# EAGLE design MPPTBatteryCharger (EAGLE 9.3.2)
Assembly variants: Wing, Hull
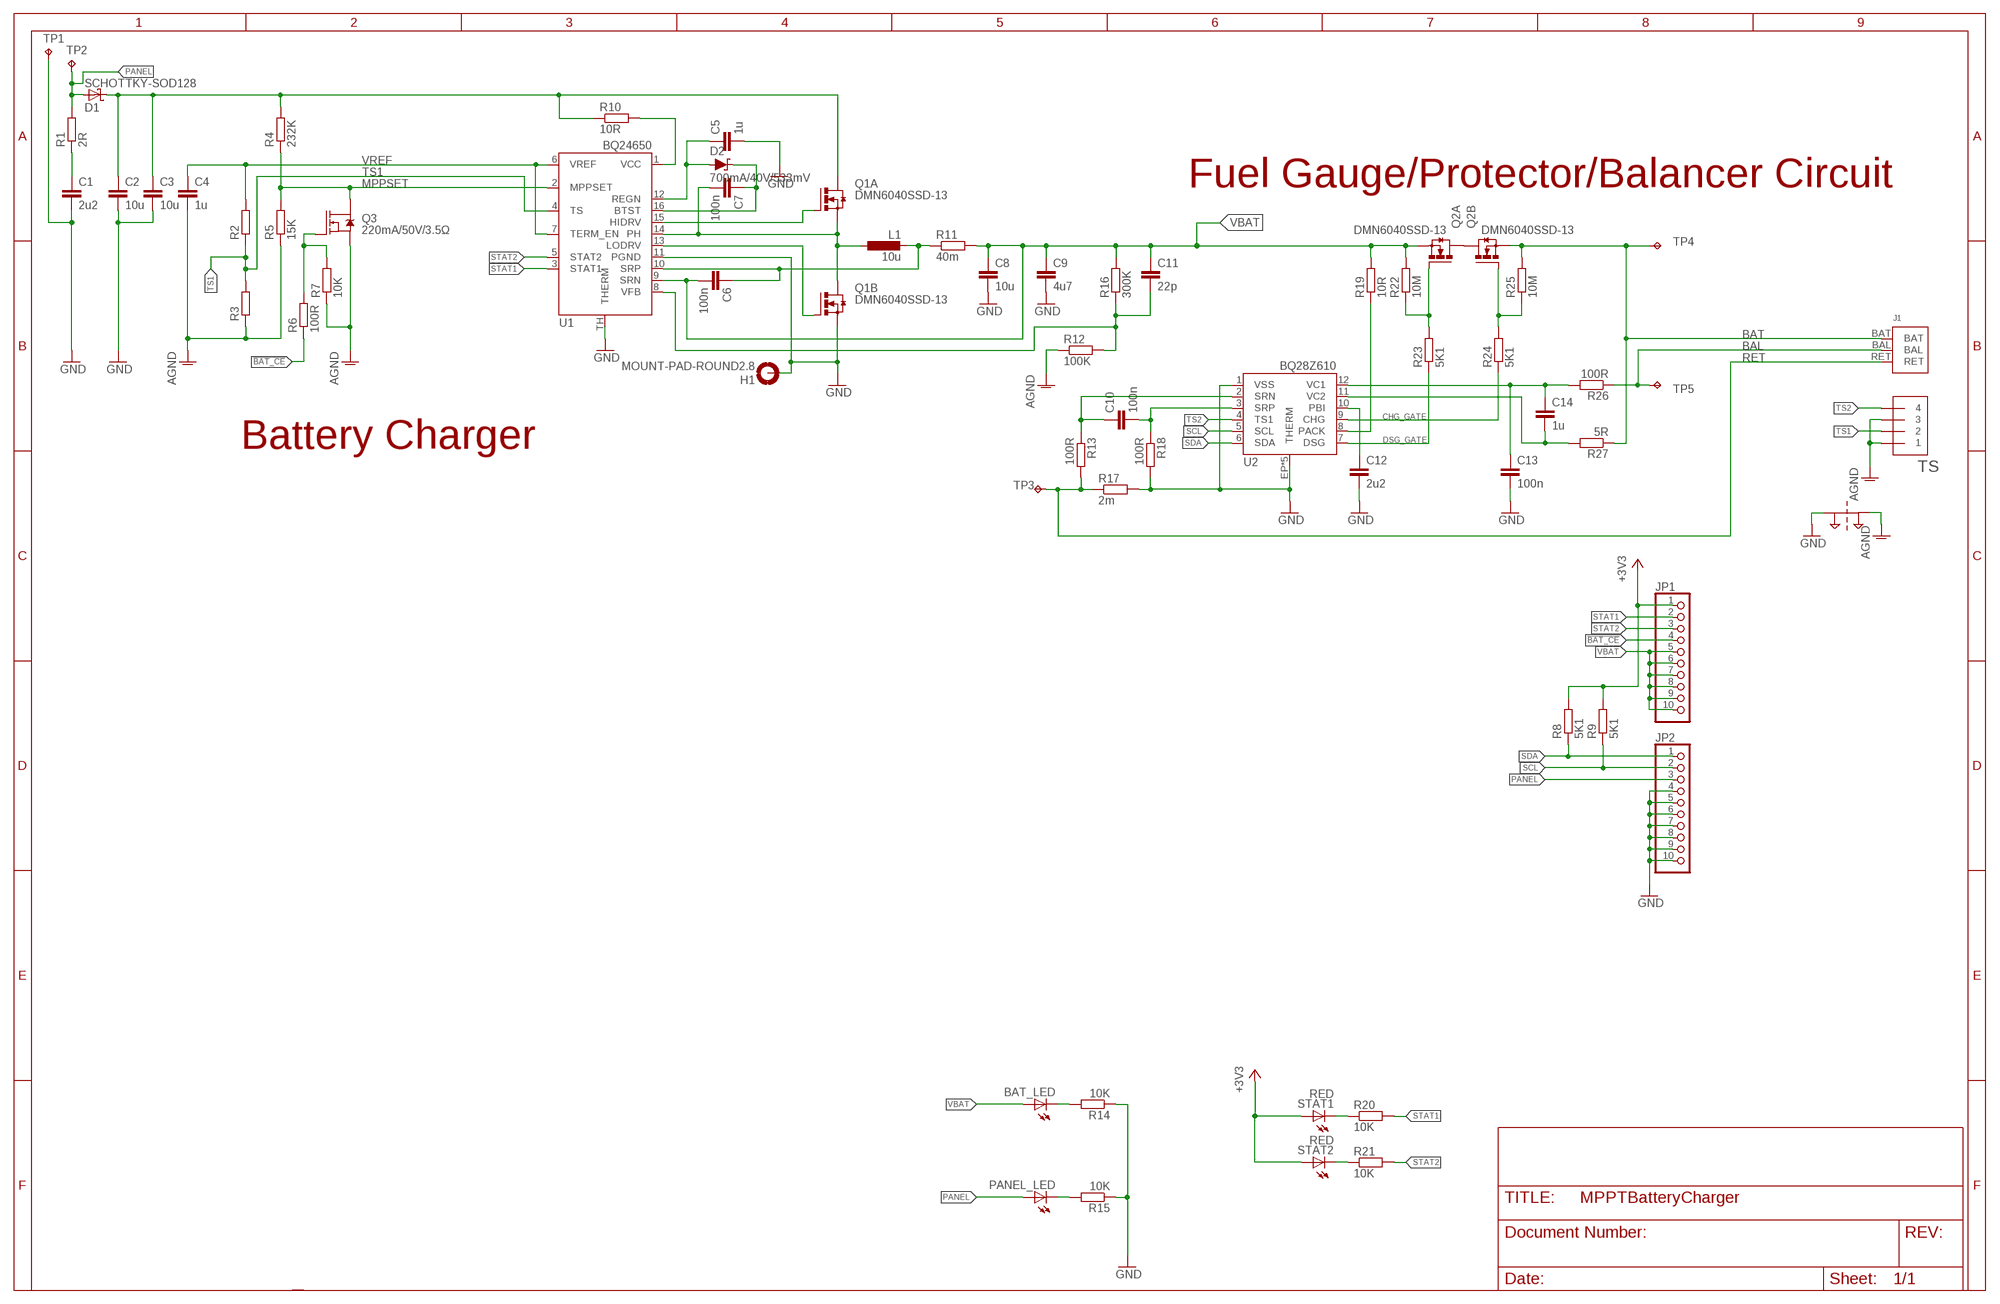
[diagram p0: schematic, sheet 1]

## Parts
BAT_LED  LEDCHIP-LED0603  [CHIP-LED0603]
C1  2u2  C-EUC0603  [C0603]
C2  10u  C-EUC1210  [C1210]
C3  10u  C-EUC1210  [C1210]
C4  1u  C-EUC0603  [C0603]
C5  1u  C-EUC0603  [C0603]
C6  100n  C-EUC0603  [C0603]
C7  100n  C-EUC0603  [C0603]
C8  10u  C-EUC1210  [C1210]
C9  4u7  C-EUC1210  [C1210]
C10  100n  C-EUC0603  [C0603]
C11  22p  C-EUC0603  [C0603]
C12  2u2  C-EUC0603  [C0603]
C13  100n  C-EUC0603  [C0603]
C14  1u  C-EUC0603  [C0603]
D1  SCHOTTKY-SOD128  [SOD-128]
D2  700mA/40V/533mV  DIODE-SCHOTTKY-ZLLS500  [SOT23-3]
H1  MOUNT-PAD-ROUND2.8  [2,8-PAD]
J1  2S-BATTERYSMD  [JST-XH3-SMD]
JP1  PINHD-1X10  [1X10]
JP2  PINHD-1X10  [1X10]
L1  10u  INDUCTOR-DG6050  [DG6050]
PANEL_LED  LEDCHIP-LED0603  [CHIP-LED0603]
Q1  DMN6040SSD-13  IRF8313P  [SO-08]
Q2  DMN6040SSD-13  IRF8313P  [SO-08]
Q3  220mA/50V/3.5Ω  MOSFET-NCH-BSS138  [SOT23-3]
R1  2R  R-EU_R0603  [R0603]
R2  R-EU_R0603  [R0603]
R3  R-EU_R0603  [R0603]
R4  232K  R-EU_R0603  [R0603]
R5  15K  R-EU_R0603  [R0603]
R6  100R  R-EU_R0603  [R0603]
R7  10K  R-EU_R0603  [R0603]
R8  5K1  R-EU_R0603  [R0603]
R9  5K1  R-EU_R0603  [R0603]
R10  10R  R-EU_R1206  [R1206]
R11  40m  R-EU_R2512  [R2512]
R12  100K  R-EU_R0603  [R0603]
R13  100R  R-EU_R0603  [R0603]
R14  10K  R-EU_R0603  [R0603]
R15  10K  R-EU_R0603  [R0603]
R16  300K  R-EU_R0603  [R0603]
R17  2m  R-EU_R2512  [R2512]
R18  100R  R-EU_R0603  [R0603]
R19  10R  R-EU_R0603  [R0603]
R20  10K  R-EU_R0603  [R0603]
R21  10K  R-EU_R0603  [R0603]
R22  10M  R-EU_R0603  [R0603]
R23  5K1  R-EU_R0603  [R0603]
R24  5K1  R-EU_R0603  [R0603]
R25  10M  R-EU_R0603  [R0603]
R26  100R  R-EU_R0603  [R0603]
R27  5R  R-EU_R0603  [R0603]
STAT1  RED  LEDCHIP-LED0603  [CHIP-LED0603]
STAT2  RED  LEDCHIP-LED0603  [CHIP-LED0603]
SUPPLY1  2PT_GND_TIE  [2PT_GND_TIE]  (not fitted in variant Wing)  (not fitted in variant Hull)
TP1  TPPAD1-13Y  [P1-13Y]  (not fitted in variant Wing)  (not fitted in variant Hull)
TP2  TPPAD1-13Y  [P1-13Y]  (not fitted in variant Wing)  (not fitted in variant Hull)
TP3  TPPAD1-13Y  [P1-13Y]  (not fitted in variant Wing)  (not fitted in variant Hull)
TP4  TPPAD1-13Y  [P1-13Y]  (not fitted in variant Wing)  (not fitted in variant Hull)
TP5  TPPAD1-13Y  [P1-13Y]  (not fitted in variant Wing)  (not fitted in variant Hull)
TS  STRAWSON_EAGLE_LIB_JST_SH_4  [STRAWSON_EAGLE_LIB_JST_SH_4_SMD]
U1  BQ24650  [QFN16]
U2  BQ28Z610  [PDSO-N12]

## Nets
!BAT_CE!: JP1.4 R6.1
+3V3: JP1.1 R8.2 R9.2 STAT1.A STAT2.A
AGND: C4.2 Q3.2(S) R3.1 R5.1 R7.1 R12.1 SUPPLY1.P$2 TS.1 TS.3
BAL: J1.BAL R26.1 TP5.TP
BAT: J1.BAT Q2.1(B:S) R25.2 R27.1 TP4.TP
CHG_GATE: R24.1 U2.9(CHG)
DSG_GATE: R23.1 U2.7(DSG)
GND: C1.2 C2.2 C3.2 C5.2 C8.2 C9.2 C12.2 C13.2 H1.B2,8(MOUNT) JP2.4 JP2.5 JP2.6 JP2.7 JP2.8 JP2.9 JP2.10 Q1.1(B:S) R14.1 R15.1 R17.2 R18.2 SUPPLY1.P$1 TP1.TP U1.11(PGND) U1.TH(THERM) U2.1(VSS) U2.EP1(THERM) U2.EP2(THERM) U2.EP3(THERM) U2.EP4(THERM) U2.EP(THERM)
MPPSET: Q3.3(D) R4.1 R5.2 U1.2(MPPSET)
N$1: C1.1 R1.1
N$3: R10.2 U1.1(VCC)
N$4: C2.1 C3.1 D1.C Q1.5(A:D) Q1.6(A:D) R4.2 R10.1
N$5: Q1.4(A:G) U1.15(HIDRV)
N$6: C7.2 L1.1 Q1.3(A:S) Q1.7(B:D) Q1.8(B:D) U1.14(PH)
N$7: Q1.2(B:G) U1.13(LODRV)
N$8: Q3.1(G) R6.2 R7.2
N$9: C6.1 L1.2 R11.1 U1.10(SRP)
N$10: C7.1 D2.3(C) U1.16(BTST)
N$11: C5.1 D2.1(A) U1.12(REGN)
N$12: C11.2 R12.2 R16.1 U1.8(VFB)
N$14: R20.1 STAT1.C
N$18: R19.1 U2.8(PACK)
N$25: Q2.5(A:D) Q2.6(A:D) Q2.7(B:D) Q2.8(B:D)
N$26: Q2.4(A:G) R22.1 R23.2
N$28: Q2.2(B:G) R24.2 R25.1
N$32: C13.1 C14.1 R26.2 U2.12(VC1)
N$33: C14.2 R27.2 U2.11(VC2)
N$34: C12.1 U2.10(PBI)
N$37: C10.1 R13.1 U2.2(SRN)
N$39: C10.2 R18.1 U2.3(SRP)
N$47: R21.1 STAT2.C
N$81: BAT_LED.C R14.2
N$83: PANEL_LED.C R15.2
PANEL: D1.A JP2.3 PANEL_LED.A R1.2 TP2.TP
RET: J1.RET R13.2 R17.1 TP3.TP
SCL: JP2.2 R9.1 U2.5(SCL)
SDA: JP2.1 R8.1 U2.6(SDA)
STAT1: JP1.2 R20.2 U1.3(STAT1)
STAT2: JP1.3 R21.2 U1.5(STAT2)
TS1: R2.1 R3.2 TS.2 U1.4(TS)
TS2: TS.4 U2.4(TS1)
VBAT: BAT_LED.A C6.2 C8.1 C9.1 C11.1 JP1.5 JP1.6 JP1.7 JP1.8 JP1.9 JP1.10 Q2.3(A:S) R11.2 R16.2 R19.2 R22.2 U1.9(SRN)
VREF: C4.1 R2.2 U1.6(VREF) U1.7(TERM_EN)

## Notes on the sheet
- Fuel Gauge/Protector/Balancer Circuit
- Battery Charger

## Library data of the parts
BAT_LED PANEL_LED STAT1 STAT2 = adafruit:LED: LED OSRAM: - CHIPLED LG R971, LG N971, LY N971, LG Q971, LY Q971, LO R971, LY R971 LH N974, LH R974 LS Q976, LO Q976, LY Q976 LO Q996 - Hyper CHIPLED LW Q18S LB Q993, LB Q99A, LB R99A - SideLED LS A670, LO A670, LY A670, LG A670, LP A670 LB A673, LV A673, LT A673, LW A673 LH A674 LY A675 LS A676, LA A676, LO A676, LY A676, LW A676 LS A679, LY A679, LG A679 - Hyper Micro SIDELED® LS Y876, LA Y876, LO Y876, LY Y876 LT Y87S - SmartLED LW L88C, LW L88S LB L89C, LB L89S, LG L890 LS L89K, LO L89K, LY L89K LS L896, LA L896, LO L896, LY L896 - TOPLED LS T670, LO T670, LY T670, LG T670, LP T670 LSG T670, LSP T670, LSY T670, LOP T670, LYG T670 LG T671, LOG T671, LSG T671 LB T673, LV T673, LT T673, LW T673 LH T674 LS T676, LA T676, LO T676, LY T676, LB T676, LH T676, LSB T676, LW T676 LB T67C, LV T67C, LT T67C, LS T67K, LO T67K, LY T67K, LW E67C LS E67B, LA E67B, LO E67B, LY E67B, LB E67C, LV E67C, LT E67C LW T67C LS T679, LY T679, LG T679 LS T770, LO T770, LY T770, LG T770, LP T770 LB T773, LV T773, LT T773, LW T773 LH T774 LS E675, LA E675, LY E675, LS T675 LS T776, LA T776, LO T776, LY T776, LB T776 LHGB T686 LT T68C, LB T68C - Hyper Mini TOPLED® LB M676 - Mini TOPLED Santana® LG M470 LS M47K, LO M47K, LY M47K Source: http://www.osram.convergy.de/
C1-C14 = resistor:C-EU: CAPACITOR, European symbol
D1 = PowerComponents:SCHOTTKY
D2 = SparkFun-DiscreteSemi:DIODE-SCHOTTKY: Schottky diode A Schottky diode is a semiconductor diode which has a low forward voltage drop and a very fast switching action.; PROD_ID: DIO-08411
H1 = holes:MOUNT-PAD-ROUND: MOUNTING PAD, round
J1 = PowerComponents:2S-BATTERY: JST XH connector for a 2S LiPo battery with balancing
JP1 JP2 = pinhead:PINHD-1X10: PIN HEADER
L1 = PowerComponents:INDUCTOR
Q1 Q2 = transistor-power:IRF8313P: HEXFET(R) Power MOSFET Source: Data sheet <http://www.irf.com/product-info/datasheets/data/irf8313pbf.pdf>
Q3 = SparkFun-DiscreteSemi:MOSFET-NCH: N-channel MOSFETs Voltage controlled devices that allow control of high current outputs. SparkFun Products: SparkFun OpenScale <https://www.sparkfun.com/products/13261> SparkFun Digital Sandbox <https://www.sparkfun.com/products/12651> SparkFun Monster Moto Shield <https://www.sparkfun.com/products/10182> SparkFun MOSFET Power Controller <https://www.sparkfun.com/products/11214>; PROD_ID: TRANS-00830
R1-R27 = resistor:R-EU_: RESISTOR, European symbol
SUPPLY1 = SparkFun-PowerSymbols:2PT_GND_TIE: Dual Ground Supply Power supply symbol for connecting two grounds. SparkFun Products: SparkFun AutoDriver - Stepper Motor Driver <https://www.sparkfun.com/products/11611>
TP1-TP5 = testpad:TP: Test pad
TS = BeagleBone_Blue:STRAWSON_EAGLE_LIB_JST_SH_4
U1 = PowerComponents:BQ24650: TI LiPo charger with MPPT
U2 = PowerComponents:BQ28Z610: 2S LiPo balancer/fuel gauge

## Board
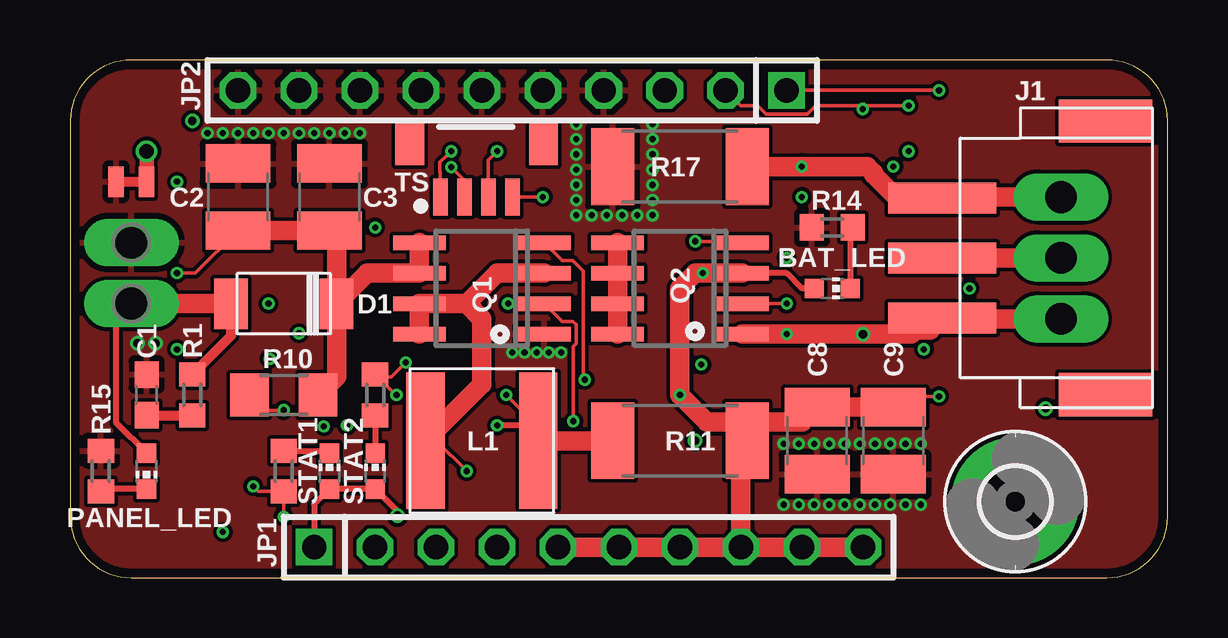
[diagram p1: board, top side]
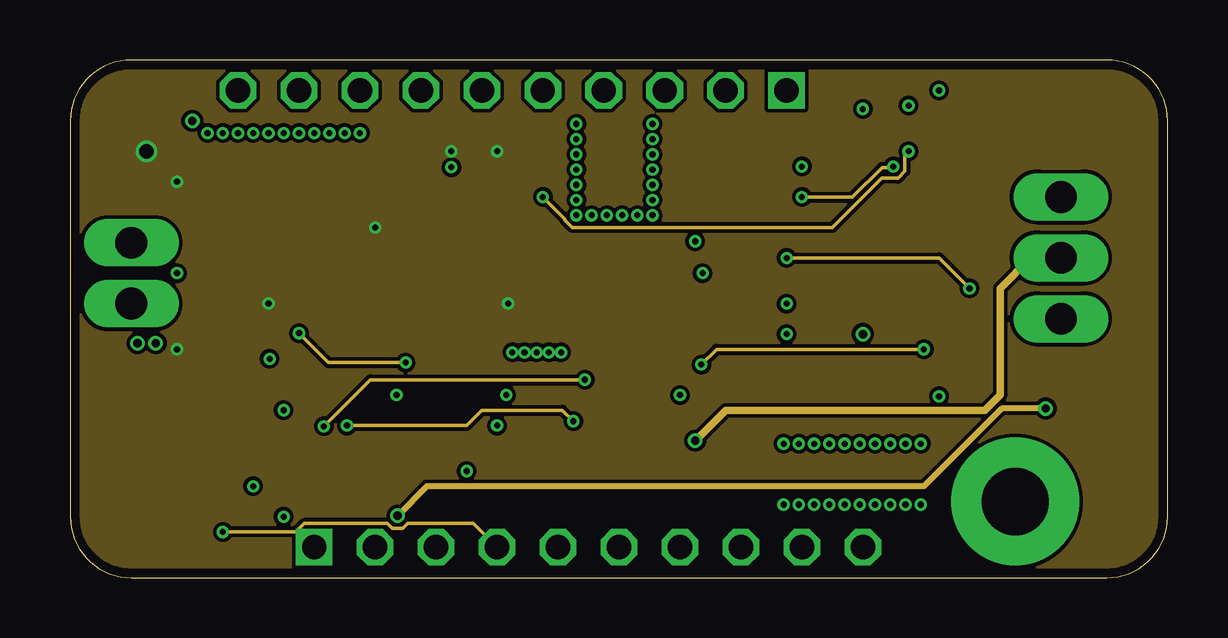
[diagram p2: board, inner layer Route2]
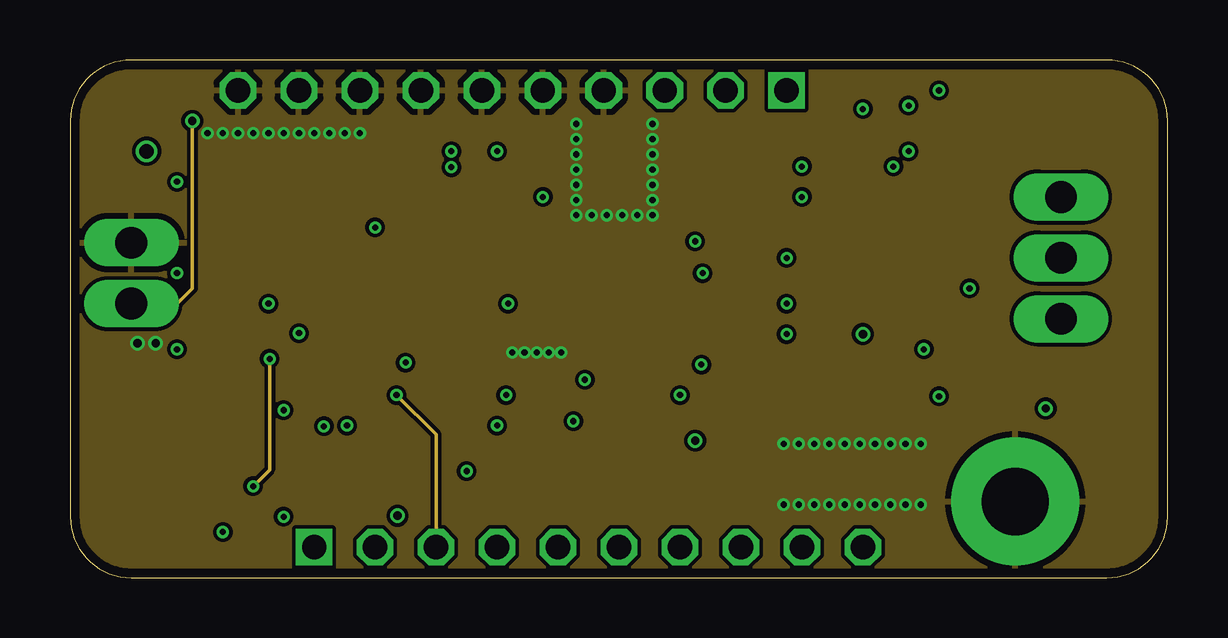
[diagram p3: board, inner layer Route15]
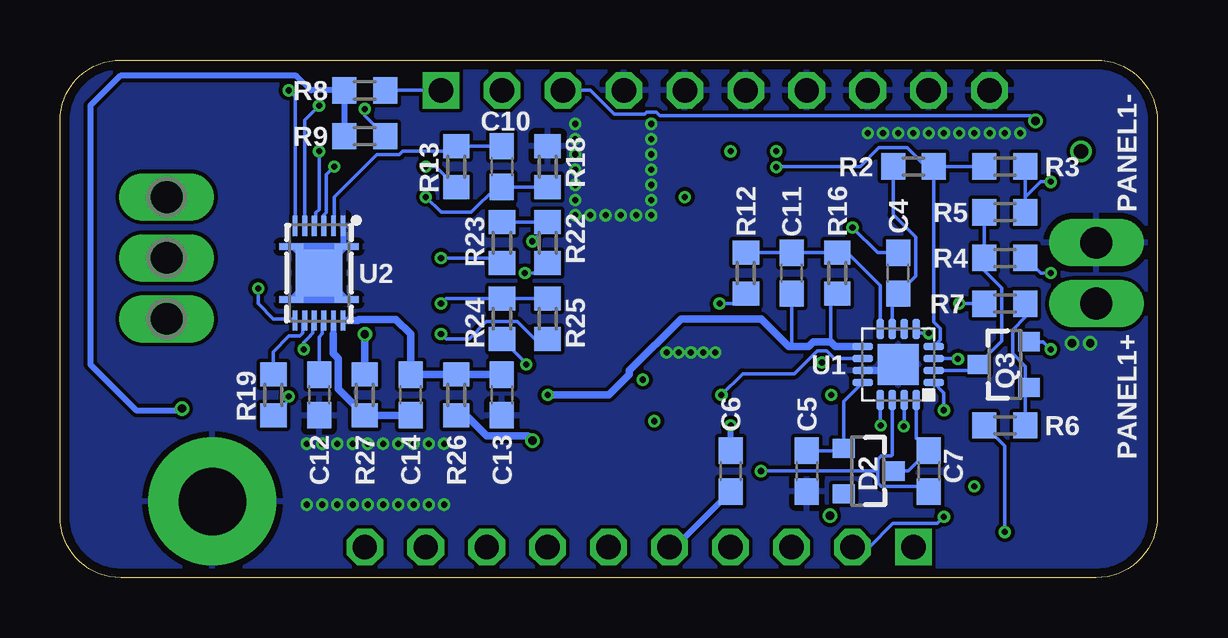
[diagram p4: board, bottom side, seen from below]

Size 45.72 x 21.59 mm. Coordinates in mm from the lower left corner, seen from the top.
Outline: 0,19.05 0,2.54 arc90 2.54,0 43.18,0 arc90 45.72,2.54 45.72,19.05 arc90 43.18,21.59 2.54,21.59 arc90 0,19.05
Copper layers (1+2*15+16): Top 0.0356mm / dielectric 1.5011mm / Route2 0.0356mm / dielectric 0.1499mm / Route15 0.0356mm / dielectric 0.2007mm / Bottom 0.0356mm
Design rules "LaenPCBOrder *": minimum track width 6mil, minimum drill 10mil, track to track 6mil, track to pad 6mil, pad to pad 6mil, via to via 6mil, smd to smd 6mil, copper to edge 15mil, drill to drill 6mil, minimum pad ring 7mil, minimum via ring 5mil, stop-mask expansion 4mil, vias tented up to drill 30mil, thermal gap 10mil

### Footprints (pad centres in the part's own frame; a part is rotated, then mirrored left to right if it is on the bottom)
CHIP-LED0603 = smd 0.8 x 0.8: A 0,-0.75; C 0,0.75
C0603 = smd 1.1 x 1: 1 -0.85,0; 2 0.85,0
C1210 = smd 1.6 x 2.7: 1 -1.4,0; 2 1.4,0
SOD-128 = smd 1.4 x 2.1: A -2.2,0; C 2.2,0
SOT23-3 = smd 0.8 x 0.9: 1 -0.95,-1; 2 0.95,-1; 3 0,1.1
2,8-PAD = drill 2.8 pad 5.334: B2,8 0,0
JST-XH3-SMD = smd 1.3 x 4.5: BAL 0,-8.75; BAT 2.5,-8.75; RET -2.5,-8.75 | smd 1.8 x 3.9: GND1 -5.7,-1.95; GND2 5.7,-1.95
1X10 = drill 1.016 square: 1 -11.43,0 | drill 1.016 octagon: 2 -8.89,0; 3 -6.35,0; 4 -3.81,0; 5 -1.27,0; 6 1.27,0; 7 3.81,0; 8 6.35,0; 9 8.89,0; 10 11.43,0
DG6050 = smd 1.6 x 5.7: 1 -2.35,0; 2 2.35,0
SO-08 = smd 0.6 x 2.2: 1 -1.905,-2.6; 2 -0.635,-2.6; 3 0.635,-2.6; 4 1.905,-2.6; 5 1.905,2.6; 6 0.635,2.6; 7 -0.635,2.6; 8 -1.905,2.6
R0603 = smd 1 x 1.1: 1 -0.85,0; 2 0.85,0
R1206 = smd 1.6 x 1.803: 1 -1.422,0; 2 1.422,0
R2512 = smd 1.8 x 3.2: 1 -2.8,0; 2 2.8,0
2PT_GND_TIE = smd 1.27 x 0.635: P$1 0,0.635; P$2 0,-0.635
P1-13Y = drill 1.321 pad 1.905 long: TP 0,0
STRAWSON_EAGLE_LIB_JST_SH_4_SMD = smd 0.6 x 1.55: 1 0.46,1.27; 2 -0.54,1.27; 3 -1.54,1.27; 4 -2.54,1.27 | smd 1.2 x 1.8: P$1 -3.84,-0.955; P$2 1.728,-0.955
QFN16 = smd 0.85 x 0.3: 1 -1.475,0.75; 2 -1.475,0.25; 3 -1.475,-0.25; 4 -1.475,-0.75; 9 1.475,-0.75; 10 1.475,-0.25; 11 1.475,0.25; 12 1.475,0.75 | smd 0.3 x 0.85: 5 -0.75,-1.475; 6 -0.25,-1.475; 7 0.25,-1.475; 8 0.75,-1.475; 13 0.75,1.475; 14 0.25,1.475; 15 -0.25,1.475; 16 -0.75,1.475 | smd 1.7 x 1.7: TH 0,0
PDSO-N12 = smd 0.2 x 0.85: 1 -1,-1.975; 2 -0.6,-1.975; 3 -0.2,-1.975; 4 0.2,-1.975; 5 0.6,-1.975; 6 1,-1.975; 7 1,1.975; 8 0.6,1.975; 9 0.2,1.975; 10 -0.2,1.975; 11 -0.6,1.975; 12 -1,1.975 | smd 1.95 x 1.95: EP 0,0 | smd 1 x 0.25: EP1 -1.15,1.1; EP2 -1.15,-1.1; EP3 1.15,-1.1; EP4 1.15,1.1

### Placement (x,y rotation side)
BAT_LED  31.75,12.06 270 top
C1  3.17,7.62 90 top
C2  6.99,15.88 90 top
C3  10.79,15.88 90 top
C4  10.79,12.7 90 bottom
C5  14.61,4.45 270 bottom
C6  17.78,4.45 270 bottom
C7  9.53,4.45 270 bottom
C8  31.11,5.71 270 top
C9  34.29,5.71 270 top
C10  27.3,17.14 270 bottom
C11  15.24,12.7 90 bottom
C12  34.92,7.62 270 bottom
C13  27.3,7.62 270 bottom
C14  31.11,7.62 270 bottom
D1  8.89,11.43 0 top
D2  12.06,4.45 270 bottom
H1  39.37,3.17 0 top
J1  45.09,13.34 270 top
JP1  21.59,1.27 0 top
JP2  18.41,20.32 180 top
L1  17.14,5.71 0 top
PANEL_LED  3.17,4.45 180 top
Q1  17.14,12.06 90 top
Q2  25.4,12.06 90 top
Q3  6.35,8.89 90 bottom
R1  5.08,7.62 90 top
R2  10.16,17.14 180 bottom
R3  6.35,17.14 180 bottom
R4  6.35,13.34 0 bottom
R5  6.35,15.24 180 bottom
R6  6.35,6.35 0 bottom
R7  6.35,11.43 0 bottom
R8  33.02,20.32 180 bottom
R9  33.02,18.41 180 bottom
R10  8.89,7.62 180 top
R11  25.4,5.71 0 top
R12  17.14,12.7 90 bottom
R13  29.21,17.14 270 bottom
R14  31.75,14.61 0 top
R15  1.27,4.45 270 top
R16  13.34,12.7 270 bottom
R17  25.4,17.14 180 top
R18  25.4,17.14 90 bottom
R19  36.83,7.62 270 bottom
R20  8.89,4.45 270 top
R21  12.7,7.62 90 top
R22  25.4,13.97 270 bottom
R23  27.3,13.97 90 bottom
R24  27.3,10.79 90 bottom
R25  25.4,10.79 270 bottom
R26  29.21,7.62 90 bottom
R27  33.02,7.62 270 bottom
STAT1  10.79,4.45 0 top
STAT2  12.7,4.45 0 top
SUPPLY1  2.54,16.51 90 top
TP1  2.54,13.97 270 top
TP2  2.54,11.43 270 top
TP3  41.27,15.88 90 bottom
TP4  41.27,10.79 90 bottom
TP5  41.27,13.34 90 bottom
TS  15.88,17.14 180 top
U1  10.79,8.89 180 bottom
U2  34.92,12.7 180 bottom

### Tracks (layer width: path | path; a pad name or v marks a point on that pad's centre or on a via)
!BAT_CE!  (via drill 0.25)
  Route2 0.152: v6.35,1.91 9.39,1.91 9.75,2.26 13.21,2.26 13.41,2.05 13.85,2.05 14.06,2.26 16.79,2.26 JP1.4
  Bottom 0.152: v6.35,1.91 6.35,5.5 R6.1
+3V3  (via drill 0.35)
  Top 0.254: JP1.1 10.16,3.06 STAT1.A STAT2.A 13.63,2.76 v13.63,2.58
  Route2 0.254: v40.64,7.06 38.81,7.06 35.56,3.81 14.86,3.81 v13.63,2.58
  Bottom 0.254: R9.2 R8.2 35.26,20.32 35.87,20.93 43.2,20.93 44.45,19.68 44.45,8.89 42.55,6.99 40.71,6.99 v40.64,7.06
AGND  (via drill 0.25, 0.6)
  Top 0.152: TS.3 17.41,17.41 v17.78,17.78 | TS.1 15.41,16.9 15.39,16.92 15.39,17.32 15.68,17.6 15.7,17.6 v15.88,17.78
  Top 0.61: SUPPLY1.P$2 v3.17,17.78
  Bottom 0.152: Q3.2 4.76,9.84 v4.45,9.53 | R12.1 17.57,11.43 v18.24,11.43 | R7.1 v8.26,11.43 | C4.2 11.64,13.55 v12.7,14.61 | R3.1 5.5,15.88 | 5.5,15.88 R5.1 | 5.5,15.88 4.87,16.51 v4.45,16.51
  pour Route2: -1.91,23.5 47.62,23.5 47.62,-1.91 -1.91,-1.91
BAL  (via drill 0.35)
  Top 0.813: TP5.TP J1.BAL
  Route2 0.305: v26.04,5.71 27.3,6.99 38.1,6.99 38.73,7.62 38.73,12.06 40.01,13.34 TP5.TP
  Bottom 0.305: R26.1 28.79,6.77 27.93,5.92 26.23,5.92 v26.04,5.71
BAT  (via drill 0.25, 0.35)
  Top 0.813: Q2.1 v29.84,10.16 v33.02,10.16 35.05,10.16 35.22,10.34 35.84,10.34 J1.BAT 36.38,10.79 TP4.TP
  Bottom 0.152: v29.84,10.16 29.63,9.95 28.68,9.95 27.95,10.67 26.66,10.67 25.93,9.95 R25.2
  Bottom 0.305: R27.1 v33.02,10.16
CHG_GATE  (via drill 0.25)
  Route2 0.152: v26.29,8.89 26.92,9.53 v35.56,9.53
  Bottom 0.152: R24.1 26.29,8.93 v26.29,8.89 | U2.9 35.2,10.65 35.2,10.21 35.29,10.11 35.29,10.08 35.56,9.81 v35.56,9.53
DSG_GATE  (via drill 0.25)
  Route2 0.152: v29.84,13.34 36.2,13.34 v37.47,12.06
  Bottom 0.152: R23.1 27.52,13.34 v29.84,13.34 | v37.47,12.06 37.47,11.43 36.83,10.79 35.99,10.79 U2.7
GND  (via drill 0.25, 0.35)
  Bottom 0.254: U2.1 33.92,13.7 | 33.92,13.7 U2.EP | U2.EP3 36.02,13.8 U2.EP | U2.EP2 33.83,13.8 33.92,13.7 | U2.EP 34.88,12.7 U2.EP1 | U2.EP 34.98,12.7 U2.EP4
  Bottom 0.305: U1.11 11.04,8.64 U1.TH
  other vias: 20.45,9.4 19.94,9.4 19.43,9.4 18.92,9.4 18.41,9.4 24.26,18.29 24.26,17.65 24.26,17.02 24.26,16.38 24.26,15.75 24.26,18.92 21.08,18.92 21.08,18.29 21.08,17.65 21.08,17.02 21.08,16.38 21.08,15.75 21.08,15.11 21.72,15.11 22.35,15.11 22.99,15.11 23.62,15.11 24.26,15.11 12.06,18.54 11.43,18.54 10.79,18.54 10.16,18.54 9.53,18.54 8.89,18.54 8.26,18.54 7.62,18.54 6.99,18.54 6.35,18.54 5.71,18.54 35.43,3.05 34.8,3.05 34.16,3.05 33.53,3.05 32.89,3.05 32.26,3.05 31.62,3.05 30.99,3.05 30.35,3.05 29.72,3.05 29.72,5.59 30.35,5.59 30.99,5.59 31.62,5.59 32.26,5.59 32.89,5.59 33.53,5.59 34.16,5.59 34.8,5.59 35.43,5.59 2.79,9.78 3.56,9.78
  pour Top: -0.64,-0.64 46.35,-0.64 46.35,22.23 -0.64,22.23
  pour Bottom: -1.27,-1.27 -1.27,22.86 46.99,22.86 46.99,-1.27
  pour Route15: -2.54,24.13 48.26,24.13 48.26,-2.54 -2.54,-2.54
MPPSET
  Bottom 0.152: U1.2 7.7,8.64 Q3.3 6.47,9.87 6.47,12.07 7.2,12.8 R4.1 R5.2
N$1
  Top 0.406: C1.1 R1.1
N$3  (via drill 0.25)
  Top 0.152: v8.89,6.99 8.1,6.99 R10.2
  Bottom 0.152: U1.1 8.89,7.71 v8.89,6.99
N$4  (via drill 0.25)
  Top 0.152: v4.45,12.7 5.21,12.7 C2.1
  Top 0.813: D1.C 12.36,12.7 Q1.6 Q1.5 | C2.1 C3.1 11.09,14.18 D1.C | D1.C 11.09,8.4 R10.1
  Bottom 0.152: R4.2 4.87,12.7 v4.45,12.7
N$5  (via drill 0.25)
  Top 0.152: v21.44,8.26 21.38,8.31 21.38,12.79 20.94,13.23 20.49,13.23 Q1.4
  Route2 0.152: v10.56,6.31 12.51,8.26 v21.44,8.26
  Bottom 0.152: U1.15 10.54,6.33 v10.56,6.31
N$6  (via drill 0.25)
  Top 0.152: v16.51,4.45 15.24,5.71 L1.1
  Top 0.813: 16.51,11.43 Q1.7 Q1.8 | Q1.3 17.78,12.7 16.51,11.43 | L1.1 17.14,8.06 17.14,10.79 16.51,11.43
  Bottom 0.152: U1.14 11.04,5.12 11.09,5.07 11.51,5.07 11.64,4.94 11.64,4.45 | 11.64,4.45 11.64,3.95 11.51,3.82 9.75,3.82 C7.2 | 11.64,4.45 v16.51,4.45
N$7  (via drill 0.25)
  Top 0.152: v20.95,6.53 20.95,9.65 21.07,9.77 21.07,10.55 20.94,10.69 20.49,10.69 Q1.2
  Route2 0.152: v11.53,6.35 16.51,6.35 17.14,6.99 20.5,6.99 v20.95,6.53
  Bottom 0.152: U1.13 11.54,6.37 v11.53,6.35
N$8
  Bottom 0.152: R6.2 5.5,7.79 | 5.5,7.79 Q3.1 | R7.2 5.5,10.86 6.03,10.34 6.03,9.35 5.5,8.82 5.5,7.79
N$9  (via drill 0.25)
  Top 0.152: v18.16,7.62 19.5,6.29 L1.2
  Top 0.254: L1.2 18.86,6.35 v17.78,6.35
  Top 0.813: R11.1 L1.2
  Bottom 0.152: U1.10 13.46,9.14 13.77,9.45 14.17,9.45 15.12,8.51 17.28,8.51 v18.16,7.62
  Bottom 0.254: C6.1 v17.78,6.35
N$10
  Bottom 0.152: D2.3 10.38,4.45 C7.1 10.04,5.82 U1.16
N$11
  Bottom 0.152: C5.1 13.16,5.29 D2.1 13.06,7.34 U1.12
N$12
  Bottom 0.152: R12.2 C11.2 R16.1 12.91,13.55 11.54,12.18 U1.8
N$14
  Top 0.254: R20.1 10.7,5.29 STAT1.C
N$18
  Bottom 0.152: R19.1 36.83,9.42 36.18,10.07 35.73,10.07 35.6,10.21 35.6,10.65 U2.8
N$25
  Top 0.813: Q2.5 Q2.6 Q2.7 Q2.8
N$26  (via drill 0.25)
  Top 0.152: Q2.4 27.94,14.03 v26.04,14.03
  Bottom 0.152: R23.2 R22.1 25.4,14.66 v26.04,14.03
N$28  (via drill 0.25)
  Top 0.152: v29.84,11.43 Q2.2
  Bottom 0.152: R25.1 R24.2 29.63,11.64 v29.84,11.43
N$32
  Bottom 0.152: U2.12 33.89,10.72
  Bottom 0.305: C13.1 R26.2 C14.1 31.11,10.16 31.72,10.77 33.27,10.77 33.31,10.72 33.89,10.72
N$33
  Bottom 0.254: U2.11 34.33,10.17
  Bottom 0.305: C14.2 R27.2 34.12,7.87 34.12,9.15 34.33,9.35 34.33,10.17
N$34
  Bottom 0.152: U2.10 34.8,10.65 34.8,10.17 34.92,10.05 C12.1
N$37
  Bottom 0.152: C10.1 R13.1 29.43,17.78 31.43,17.78 31.57,17.64 32.53,17.64 34.29,15.88 34.29,14.71 U2.2
N$39  (via drill 0.25)
  Route2 0.152: v30.48,15.88 32.59,15.88 33.82,17.11 34.25,17.11 v34.29,17.14
  Bottom 0.152: R18.1 C10.2 27.52,16.3 28.57,15.24 29.84,15.24 v30.48,15.88 | v34.29,17.14 34.62,16.82 34.62,15.23 34.73,15.12 U2.3
N$47
  Top 0.254: R21.1 STAT2.C
N$81
  Top 0.254: R14.2 32.5,14.51 BAT_LED.C
N$83
  Top 0.254: PANEL_LED.C 1.37,3.69 R15.2
PANEL  (via drill 0.35)
  Top 0.254: PANEL_LED.A 1.91,6.46 1.91,10.79 TP2.TP
  Top 0.406: D1.A 6.69,10.08 R1.2
  Top 0.813: TP2.TP D1.A
  Route15 0.152: v5.08,19.05 5.08,12.06 4.45,11.43 TP2.TP
  Bottom 0.152: JP2.3 23.63,20.32 22.64,19.33 21.36,19.33 21.28,19.41 20.88,19.41 20.74,19.26 5.29,19.26 v5.08,19.05
RET  (via drill 0.25)
  Top 0.813: R17.1 v30.48,17.14 33.2,17.14 33.48,16.87 33.48,16.81 34.45,15.84 J1.RET 36.38,15.88 TP3.TP
  Bottom 0.152: R13.2 30.06,17.14 v30.48,17.14
SCL  (via drill 0.25)
  Top 0.152: v34.92,19.68 33.02,19.68 | 33.02,19.68 31.06,19.68 30.7,19.33 28.99,19.33 28.63,19.68 27.94,19.68 JP2.2 | v33.02,19.55 33.02,19.68
  Bottom 0.152: U2.5 35.52,19.09 v34.92,19.68 | R9.1 33.02,19.27 v33.02,19.55
SDA  (via drill 0.25)
  Top 0.152: v36.2,20.32 JP2.1
  Bottom 0.152: U2.6 35.92,20.05 v36.2,20.32 | R8.1 JP2.1
STAT1  (via drill 0.25)
  Top 0.152: v8.89,2.54 R20.2 7.83,3.6 v7.62,3.81
  Route15 0.152: v8.31,9.12 8.31,4.5 v7.62,3.81
  Bottom 0.152: v8.89,2.54 9.17,2.26 11.02,2.26 12.01,1.27 JP1.2 | U1.3 8.32,9.14 v8.31,9.12
STAT2  (via drill 0.25)
  Top 0.152: R21.2 12.81,8.36 | 12.81,8.36 13.55,7.62 v13.59,7.62 | v13.97,8.97 13.36,8.36 12.81,8.36
  Route2 0.152: v9.53,10.2 10.75,8.97 v13.97,8.97
  Route15 0.152: JP1.3 15.24,5.97 v13.59,7.62
  Bottom 0.152: U1.5 9.88,10.2 v9.53,10.2
TS1  (via drill 0.25)
  Top 0.152: v15.88,17.12 16.41,16.58 TS.2
  Bottom 0.152: R2.1 R3.2 | R2.1 9.31,10.66 9.04,10.4 9.04,9.92 U1.4 | v15.88,17.12 15.85,17.14 12.38,17.14 11.61,17.92 10.41,17.92 9.64,17.14 R2.1
TS2  (via drill 0.25)
  Top 0.152: v19.68,15.88 TS.4
  Route2 0.152: v34.92,17.78 34.77,17.63 34.77,16.95 34.49,16.66 33.81,16.66 31.75,14.61 20.91,14.61 20.6,14.91 20.6,14.96 v19.68,15.88
  Bottom 0.152: U2.4 35.05,14.75 35.05,15.23 34.92,15.35 v34.92,17.78
VBAT  (via drill 0.25)
  Top 0.152: v36.2,7.56 34.74,7.56 C9.1
  Top 0.254: BAT_LED.A 30.48,12.06 29.84,12.7 Q2.3
  Top 0.813: Q2.3 v26.35,12.7 26.04,12.7 25.4,12.06 v25.4,7.62 26.52,6.5 27.41,6.5 | 27.41,6.5 30.5,6.5 C8.1 C9.1 | JP1.8 27.94,5.46 R11.2 27.41,6.5 | JP1.8 JP1.7 JP1.6 JP1.5 | JP1.8 JP1.9 JP1.10
  Bottom 0.152: R16.2 13.61,11.57 13.61,9.84 | C11.1 15.24,9.64 | R22.2 25.82,12.7 v26.35,12.7 | R19.2 36.2,7.41 v36.2,7.56
  Bottom 0.254: C6.2 20.11,1.27 JP1.5
  Bottom 0.305: U1.9 13.42,9.64 13.61,9.84 14.33,9.84 14.52,9.64 15.24,9.64 15.36,9.64 16.51,10.79 19.84,10.79 22,8.64 22,8.48 22.86,7.62 v25.4,7.62
VREF
  Bottom 0.152: U1.6 U1.7 11.04,11.6 C4.1 10.07,12.58 10.07,14.2 11.01,15.14 R2.2

### Text on the board
bPlace: PANEL1- | PANEL1+